# Altium schematic sheet VALVEBOARD_ValvePower_ValveInterface.SchDoc
size A3; SheetNumber: 3; SheetTotal: 7
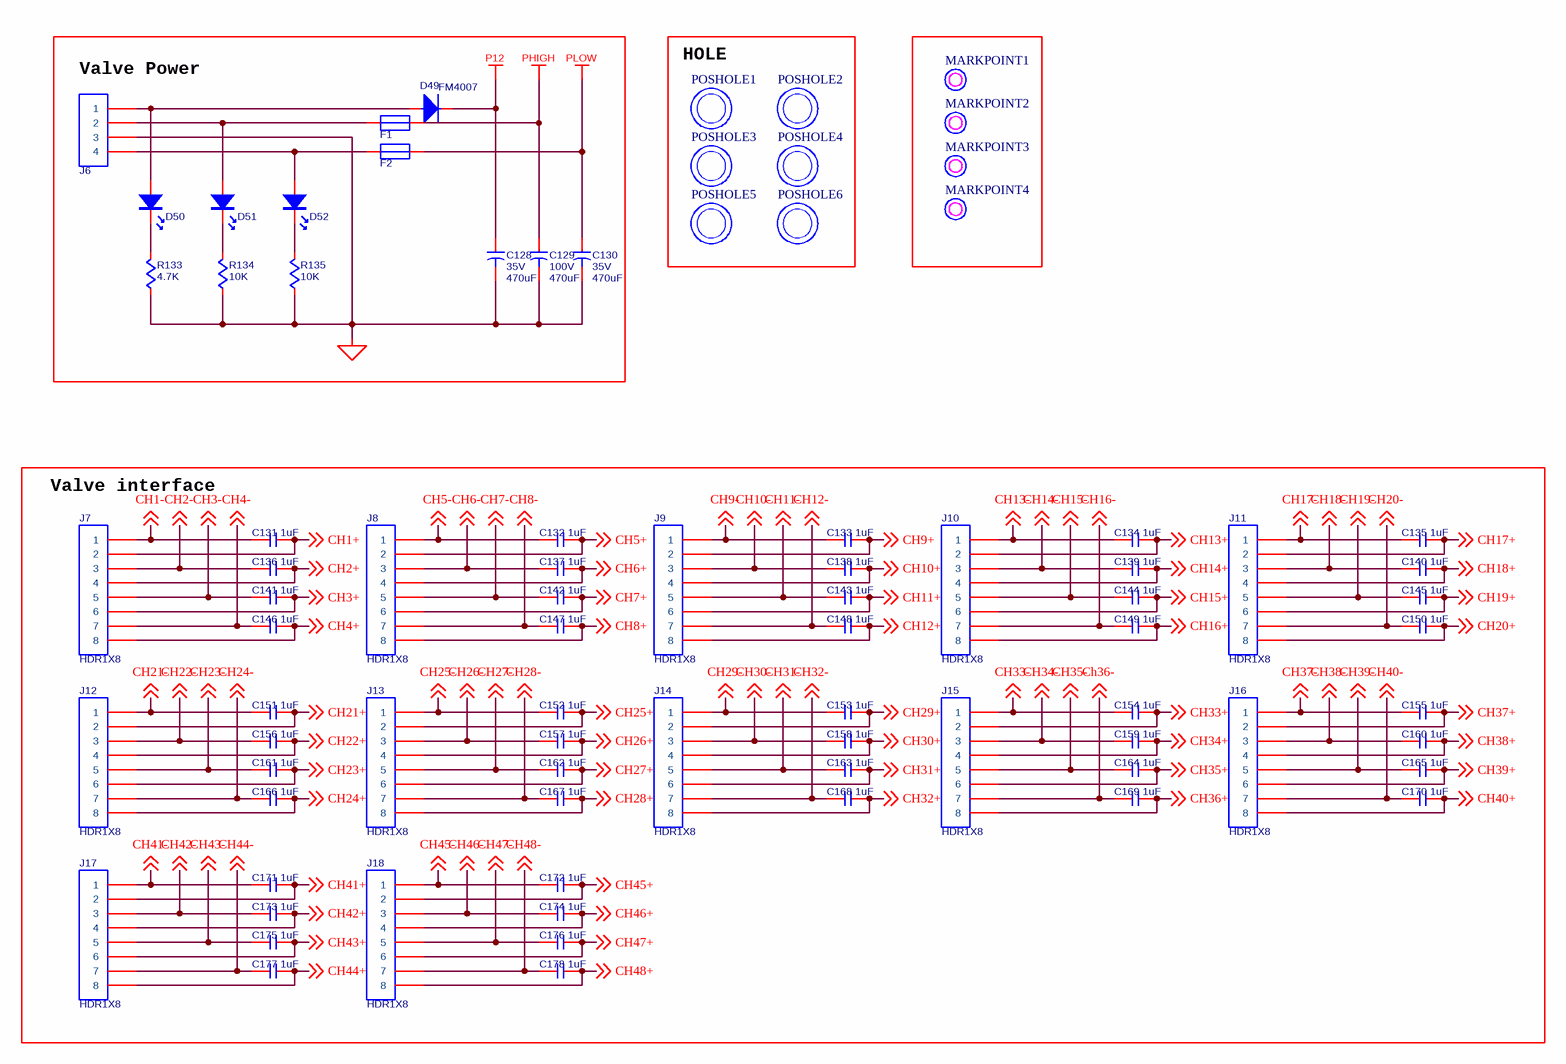
[diagram p0: VALVEBOARD_ValvePower_ValveInterface.SchDoc]

## Parts
C128  value 470uF  voltage: 35V  [C_10_10R2]  (hidden comment: C-POL)
C129  value 470uF  voltage: 100V  [C_18_21]  (hidden comment: C-POL)
C130  value 470uF  voltage: 35V  [C_10_10R2]  (hidden comment: C-POL)
C131  value 1uF  [C0805]  (hidden comment: C-NOMO)
C132  value 1uF  [C0805]  (hidden comment: C-NOMO)
C133  value 1uF  [C0805]  (hidden comment: C-NOMO)
C134  value 1uF  [C0805]  (hidden comment: C-NOMO)
C135  value 1uF  [C0805]  (hidden comment: C-NOMO)
C136  value 1uF  [C0805]  (hidden comment: C-NOMO)
C137  value 1uF  [C0805]  (hidden comment: C-NOMO)
C138  value 1uF  [C0805]  (hidden comment: C-NOMO)
C139  value 1uF  [C0805]  (hidden comment: C-NOMO)
C140  value 1uF  [C0805]  (hidden comment: C-NOMO)
C141  value 1uF  [C0805]  (hidden comment: C-NOMO)
C142  value 1uF  [C0805]  (hidden comment: C-NOMO)
C143  value 1uF  [C0805]  (hidden comment: C-NOMO)
C144  value 1uF  [C0805]  (hidden comment: C-NOMO)
C145  value 1uF  [C0805]  (hidden comment: C-NOMO)
C146  value 1uF  [C0805]  (hidden comment: C-NOMO)
C147  value 1uF  [C0805]  (hidden comment: C-NOMO)
C148  value 1uF  [C0805]  (hidden comment: C-NOMO)
C149  value 1uF  [C0805]  (hidden comment: C-NOMO)
C150  value 1uF  [C0805]  (hidden comment: C-NOMO)
C151  value 1uF  [C0805]  (hidden comment: C-NOMO)
C152  value 1uF  [C0805]  (hidden comment: C-NOMO)
C153  value 1uF  [C0805]  (hidden comment: C-NOMO)
C154  value 1uF  [C0805]  (hidden comment: C-NOMO)
C155  value 1uF  [C0805]  (hidden comment: C-NOMO)
C156  value 1uF  [C0805]  (hidden comment: C-NOMO)
C157  value 1uF  [C0805]  (hidden comment: C-NOMO)
C158  value 1uF  [C0805]  (hidden comment: C-NOMO)
C159  value 1uF  [C0805]  (hidden comment: C-NOMO)
C160  value 1uF  [C0805]  (hidden comment: C-NOMO)
C161  value 1uF  [C0805]  (hidden comment: C-NOMO)
C162  value 1uF  [C0805]  (hidden comment: C-NOMO)
C163  value 1uF  [C0805]  (hidden comment: C-NOMO)
C164  value 1uF  [C0805]  (hidden comment: C-NOMO)
C165  value 1uF  [C0805]  (hidden comment: C-NOMO)
C166  value 1uF  [C0805]  (hidden comment: C-NOMO)
C167  value 1uF  [C0805]  (hidden comment: C-NOMO)
C168  value 1uF  [C0805]  (hidden comment: C-NOMO)
C169  value 1uF  [C0805]  (hidden comment: C-NOMO)
C170  value 1uF  [C0805]  (hidden comment: C-NOMO)
C171  value 1uF  [C0805]  (hidden comment: C-NOMO)
C172  value 1uF  [C0805]  (hidden comment: C-NOMO)
C173  value 1uF  [C0805]  (hidden comment: C-NOMO)
C174  value 1uF  [C0805]  (hidden comment: C-NOMO)
C175  value 1uF  [C0805]  (hidden comment: C-NOMO)
C176  value 1uF  [C0805]  (hidden comment: C-NOMO)
C177  value 1uF  [C0805]  (hidden comment: C-NOMO)
C178  value 1uF  [C0805]  (hidden comment: C-NOMO)
D49  FM4007  [FM4007-T(A7)]
D50  LED  [LED0603]  (value not drawn)
D51  LED  [LED0603]  (value not drawn)
D52  LED  [LED0603]  (value not drawn)
F1  F50  [F-TH2]  (value not drawn)
F2  F50  [F-TH2]  (value not drawn)
J6  HDR1X4  [KF301-5.0-4P]  (value not drawn)
J7  HDR1X8  [KF15EDGK-3.81-8P]
J8  HDR1X8  [KF15EDGK-3.81-8P]
J9  HDR1X8  [KF15EDGK-3.81-8P]
J10  HDR1X8  [KF15EDGK-3.81-8P]
J11  HDR1X8  [KF15EDGK-3.81-8P]
J12  HDR1X8  [KF15EDGK-3.81-8P]
J13  HDR1X8  [KF15EDGK-3.81-8P]
J14  HDR1X8  [KF15EDGK-3.81-8P]
J15  HDR1X8  [KF15EDGK-3.81-8P]
J16  HDR1X8  [KF15EDGK-3.81-8P]
J17  HDR1X8  [KF15EDGK-3.81-8P]
J18  HDR1X8  [KF15EDGK-3.81-8P]
MARKPOINT1  MARKPOINT  [MARKPOINT-1.0]  (value not drawn)
MARKPOINT2  MARKPOINT  [MARKPOINT-1.0]  (value not drawn)
MARKPOINT3  MARKPOINT  [MARKPOINT-1.0]  (value not drawn)
MARKPOINT4  MARKPOINT  [MARKPOINT-1.0]  (value not drawn)
POSHOLE1  POSHOLE  [POSHOLE-3.2]  (value not drawn)
POSHOLE2  POSHOLE  [POSHOLE-3.2]  (value not drawn)
POSHOLE3  POSHOLE  [POSHOLE-3.2]  (value not drawn)
POSHOLE4  POSHOLE  [POSHOLE-3.2]  (value not drawn)
POSHOLE5  POSHOLE  [POSHOLE-3.2]  (value not drawn)
POSHOLE6  POSHOLE  [POSHOLE-3.2]  (value not drawn)
R133  value 4.7K  [R0402]  (hidden comment: R)
R134  value 10K  [R0402]  (hidden comment: R)
R135  value 10K  [R0402]  (hidden comment: R)

## Blocks framed on the sheet
Valve Power: C128-C130 D49-D52 F1 F2 J6 R133-R135
HOLE: POSHOLE1-POSHOLE6
Valve interface: C131-C178 J7-J18

## Nets
P12: C128.1(S) D49.1
PGND: C128.2 C129.2 C130.2 J6.3 R133.2 R134.2 R135.2
PHIGH: C129.1 F1.2
PLOW: C130.1(S) F2.2
CH1+: C131.1 J7.2 ; off-sheet CH1+
CH1-: C131.2 J7.1 ; off-sheet CH1-
CH2+: C136.1 J7.4 ; off-sheet CH2+
CH2-: C136.2 J7.3 ; off-sheet CH2-
CH3+: C141.1 J7.6 ; off-sheet CH3+
CH3-: C141.2 J7.5 ; off-sheet CH3-
CH4+: C146.1 J7.8 ; off-sheet CH4+
CH4-: C146.2 J7.7 ; off-sheet CH4-
CH5+: C132.1 J8.2 ; off-sheet CH5+
CH5-: C132.2 J8.1 ; off-sheet CH5-
CH6+: C137.1 J8.4 ; off-sheet CH6+
CH6-: C137.2 J8.3 ; off-sheet CH6-
CH7+: C142.1 J8.6 ; off-sheet CH7+
CH7-: C142.2 J8.5 ; off-sheet CH7-
CH8+: C147.1 J8.8 ; off-sheet CH8+
CH8-: C147.2 J8.7 ; off-sheet CH8-
CH9+: C133.1 J9.2 ; off-sheet CH9+
CH9-: C133.2 J9.1 ; off-sheet CH9-
CH10+: C138.1 J9.4 ; off-sheet CH10+
CH10-: C138.2 J9.3 ; off-sheet CH10-
CH11+: C143.1 J9.6 ; off-sheet CH11+
CH11-: C143.2 J9.5 ; off-sheet CH11-
CH12+: C148.1 J9.8 ; off-sheet CH12+
CH12-: C148.2 J9.7 ; off-sheet CH12-
CH13+: C134.1 J10.2 ; off-sheet CH13+
CH13-: C134.2 J10.1 ; off-sheet CH13-
CH14+: C139.1 J10.4 ; off-sheet CH14+
CH14-: C139.2 J10.3 ; off-sheet CH14-
CH15+: C144.1 J10.6 ; off-sheet CH15+
CH15-: C144.2 J10.5 ; off-sheet CH15-
CH16+: C149.1 J10.8 ; off-sheet CH16+
CH16-: C149.2 J10.7 ; off-sheet CH16-
CH17+: C135.1 J11.2 ; off-sheet CH17+
CH17-: C135.2 J11.1 ; off-sheet CH17-
CH18+: C140.1 J11.4 ; off-sheet CH18+
CH18-: C140.2 J11.3 ; off-sheet CH18-
CH19+: C145.1 J11.6 ; off-sheet CH19+
CH19-: C145.2 J11.5 ; off-sheet CH19-
CH20+: C150.1 J11.8 ; off-sheet CH20+
CH20-: C150.2 J11.7 ; off-sheet CH20-
CH21+: C151.1 J12.2 ; off-sheet CH21+
CH21-: C151.2 J12.1 ; off-sheet CH21-
CH22+: C156.1 J12.4 ; off-sheet CH22+
CH22-: C156.2 J12.3 ; off-sheet CH22-
CH23+: C161.1 J12.6 ; off-sheet CH23+
CH23-: C161.2 J12.5 ; off-sheet CH23-
CH24+: C166.1 J12.8 ; off-sheet CH24+
CH24-: C166.2 J12.7 ; off-sheet CH24-
CH25+: C152.1 J13.2 ; off-sheet CH25+
CH25-: C152.2 J13.1 ; off-sheet CH25-
CH26+: C157.1 J13.4 ; off-sheet CH26+
CH26-: C157.2 J13.3 ; off-sheet CH26-
CH27+: C162.1 J13.6 ; off-sheet CH27+
CH27-: C162.2 J13.5 ; off-sheet CH27-
CH28+: C167.1 J13.8 ; off-sheet CH28+
CH28-: C167.2 J13.7 ; off-sheet CH28-
CH29+: C153.1 J14.2 ; off-sheet CH29+
CH29-: C153.2 J14.1 ; off-sheet CH29-
CH30+: C158.1 J14.4 ; off-sheet CH30+
CH30-: C158.2 J14.3 ; off-sheet CH30-
CH31+: C163.1 J14.6 ; off-sheet CH31+
CH31-: C163.2 J14.5 ; off-sheet CH31-
CH32+: C168.1 J14.8 ; off-sheet CH32+
CH32-: C168.2 J14.7 ; off-sheet CH32-
CH33+: C154.1 J15.2 ; off-sheet CH33+
CH33-: C154.2 J15.1 ; off-sheet CH33-
CH34+: C159.1 J15.4 ; off-sheet CH34+
CH34-: C159.2 J15.3 ; off-sheet CH34-
CH35+: C164.1 J15.6 ; off-sheet CH35+
CH35-: C164.2 J15.5 ; off-sheet CH35-
CH36+: C169.1 J15.8 ; off-sheet CH36+
Ch36-: C169.2 J15.7 ; off-sheet Ch36-
CH37+: C155.1 J16.2 ; off-sheet CH37+
CH37-: C155.2 J16.1 ; off-sheet CH37-
CH38+: C160.1 J16.4 ; off-sheet CH38+
CH38-: C160.2 J16.3 ; off-sheet CH38-
CH39+: C165.1 J16.6 ; off-sheet CH39+
CH39-: C165.2 J16.5 ; off-sheet CH39-
CH40+: C170.1 J16.8 ; off-sheet CH40+
CH40-: C170.2 J16.7 ; off-sheet CH40-
CH41+: C171.1 J17.2 ; off-sheet CH41+
CH41-: C171.2 J17.1 ; off-sheet CH41-
CH42+: C173.1 J17.4 ; off-sheet CH42+
CH42-: C173.2 J17.3 ; off-sheet CH42-
CH43+: C175.1 J17.6 ; off-sheet CH43+
CH43-: C175.2 J17.5 ; off-sheet CH43-
CH44+: C177.1 J17.8 ; off-sheet CH44+
CH44-: C177.2 J17.7 ; off-sheet CH44-
CH45+: C172.1 J18.2 ; off-sheet CH45+
CH45-: C172.2 J18.1 ; off-sheet CH45-
CH46+: C174.1 J18.4 ; off-sheet CH46+
CH46-: C174.2 J18.3 ; off-sheet CH46-
CH47+: C176.1 J18.6 ; off-sheet CH47+
CH47-: C176.2 J18.5 ; off-sheet CH47-
CH48+: C178.1 J18.8 ; off-sheet CH48+
CH48-: C178.2 J18.7 ; off-sheet CH48-
NetD49_2: D49.2 D50.2 J6.1
NetD50_1: D50.1 R133.1
NetD51_1: D51.1 R134.1
NetD51_2: D51.2 F1.1 J6.2
NetD52_1: D52.1 R135.1
NetD52_2: D52.2 F2.1 J6.4

## Library data of the parts
C131-C178 = C-NOMO: voltage: 25V; precision: 5%
R133-R135 = R: precision: 1%